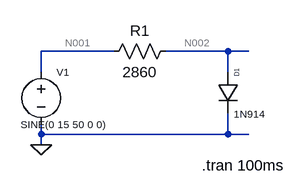
[diagram p0: schematic Diode_Clipping_Circuit.asc]
Diode_Clipping_Circuit.asc, the LTspice schematic file:
Version 4
SHEET 1 880 680
WIRE 48 0 -64 0
WIRE 224 0 128 0
WIRE 256 0 224 0
WIRE -64 32 -64 0
WIRE 224 32 224 0
WIRE -64 128 -64 112
WIRE 224 128 224 96
WIRE 224 128 -64 128
WIRE 256 128 224 128
WIRE -64 144 -64 128
FLAG -64 144 0
SYMBOL diode 208 32 R0
WINDOW 0 36 1 VBottom 0
WINDOW 3 49 54 Top 1
SYMATTR InstName D1
SYMATTR Value 1N914
SYMBOL res 144 -16 R90
WINDOW 0 0 56 VBottom 2
WINDOW 3 32 56 VTop 2
SYMATTR InstName R1
SYMATTR Value 2860
SYMBOL voltage -64 16 R0
WINDOW 0 24 16 Left 1
WINDOW 3 33 86 Top 1
WINDOW 123 0 0 Left 0
WINDOW 39 0 0 Left 0
SYMATTR InstName V1
SYMATTR Value SINE(0 15 50 0 0)
TEXT 184 176 Left 2 !.tran 100ms

The netlist it stands for:
* Diode_Clipping_Circuit.asc
D1 N002 0 1N914
R1 N002 N001 2860
V1 N001 0 SINE(0 15 50 0 0)
.model D D
.lib standard.dio
.tran 100ms
.backanno
.end

* Results of the author's LTspice run, read from the files saved beside the schematic
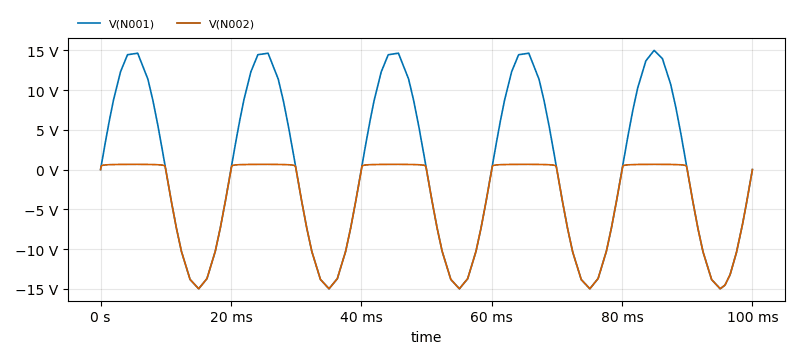
[diagram p1: Transient Analysis of Diode_Clipping_Circuit.asc, plotted from the saved traces]
* Transient Analysis, 1 run:
*   V(N001): min -15 V, max 15 V, average -8.266 mV, rms 10.52 V, last 0 V
*   V(N002): min -14.99 V, max 660.1 mV, average -4.414 V, rms 7.462 V, last -71.82 µV